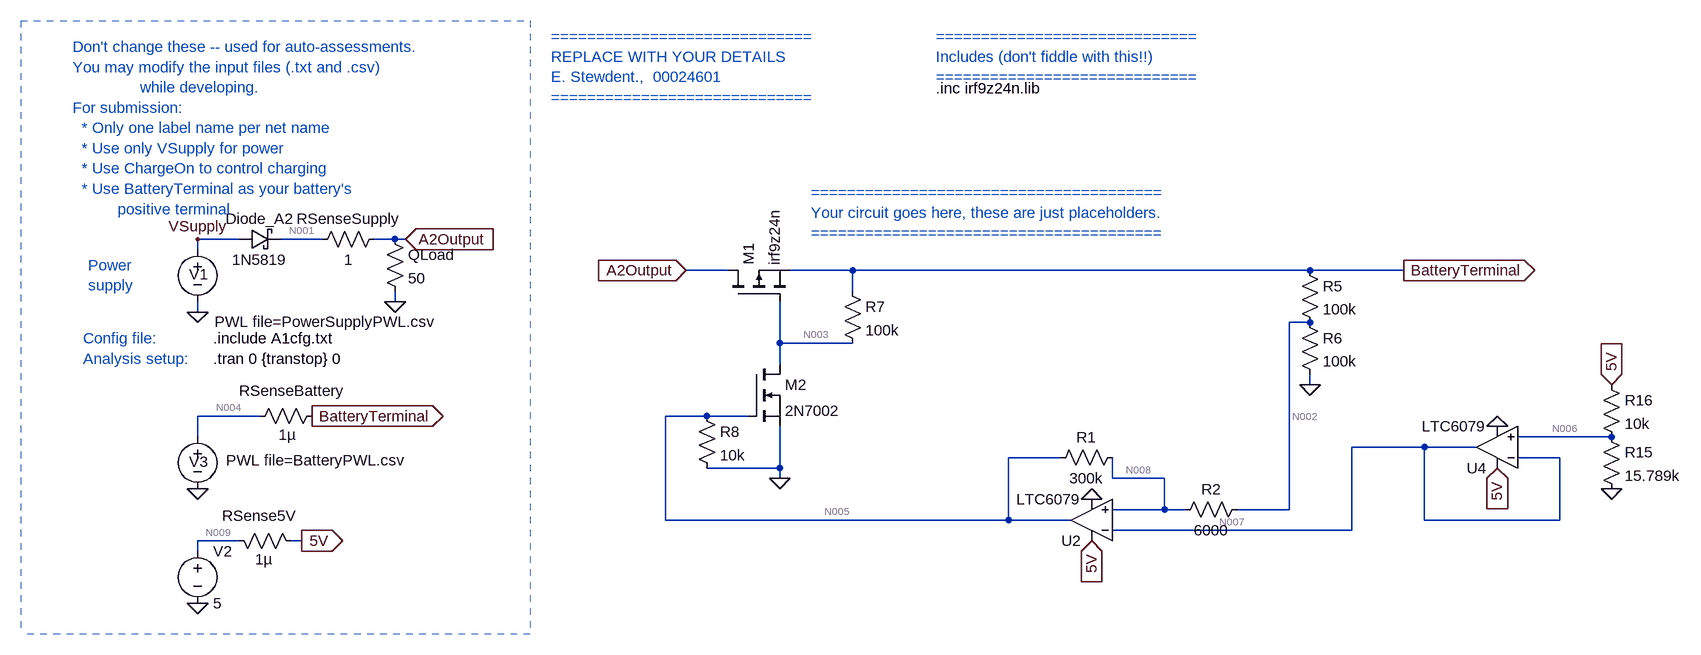
[diagram p0: schematic E344_XXXXXXXX_A3 - Copy.asc]
E344_XXXXXXXX_A3 - Copy.asc, the LTspice schematic file:
Version 4
SHEET 1 1824 680
WIRE -2032 -1088 -2096 -1088
WIRE -1904 -1088 -1968 -1088
WIRE -1792 -1088 -1824 -1088
WIRE -1776 -1088 -1792 -1088
WIRE -2096 -1072 -2096 -1088
WIRE -1280 -1040 -1344 -1040
WIRE -1088 -1040 -1184 -1040
WIRE -384 -1040 -1088 -1040
WIRE -240 -1040 -384 -1040
WIRE -1088 -1008 -1088 -1040
WIRE -1792 -992 -1792 -1008
WIRE -2096 -976 -2096 -992
WIRE -384 -960 -416 -960
WIRE -1200 -928 -1200 -992
WIRE -1088 -928 -1200 -928
WIRE -1200 -896 -1200 -928
WIRE -384 -864 -384 -880
WIRE -2000 -816 -2096 -816
WIRE -1312 -816 -1376 -816
WIRE -1248 -816 -1312 -816
WIRE -2096 -784 -2096 -816
WIRE 80 -784 -64 -784
WIRE -208 -768 -320 -768
WIRE -128 -768 -208 -768
WIRE -768 -752 -848 -752
WIRE 0 -752 -64 -752
WIRE -1200 -736 -1200 -800
WIRE -1200 -736 -1312 -736
WIRE -1200 -720 -1200 -736
WIRE -688 -720 -688 -752
WIRE -608 -720 -688 -720
WIRE -608 -672 -608 -720
WIRE -608 -672 -688 -672
WIRE -576 -672 -608 -672
WIRE -416 -672 -416 -960
WIRE -416 -672 -496 -672
WIRE -1376 -656 -1376 -816
WIRE -848 -656 -848 -752
WIRE -848 -656 -1376 -656
WIRE -752 -656 -848 -656
WIRE -208 -656 -208 -768
WIRE 0 -656 0 -752
WIRE 0 -656 -208 -656
WIRE -320 -640 -320 -768
WIRE -320 -640 -688 -640
WIRE -2032 -624 -2096 -624
WIRE -1936 -624 -1952 -624
WIRE -2096 -608 -2096 -624
FLAG -2096 -976 0
FLAG -1776 -1088 A2Output
IOPIN -1776 -1088 In
FLAG -1920 -816 BatteryTerminal
IOPIN -1920 -816 Out
FLAG -2096 -704 0
FLAG -1936 -624 5V
IOPIN -1936 -624 Out
FLAG -2096 -1088 VSupply
FLAG -1792 -992 0
FLAG -2096 -528 0
FLAG -1200 -720 0
FLAG -720 -624 5V
IOPIN -720 -624 In
FLAG -96 -736 5V
IOPIN -96 -736 In
FLAG 80 -864 5V
IOPIN 80 -864 In
FLAG -720 -688 0
FLAG -96 -800 0
FLAG -384 -864 0
FLAG 80 -704 0
FLAG -240 -1040 BatteryTerminal
IOPIN -240 -1040 Out
FLAG -1344 -1040 A2Output
IOPIN -1344 -1040 In
SYMBOL voltage -2096 -1088 R0
WINDOW 123 0 0 Left 0
WINDOW 39 0 0 Left 0
WINDOW 3 26 127 Left 2
WINDOW 0 -13 54 Left 2
SYMATTR Value PWL file=PowerSupplyPWL.csv
SYMATTR InstName V1
SYMBOL res -1904 -832 R90
WINDOW 0 -7 47 VBottom 2
WINDOW 3 29 54 VTop 2
SYMATTR InstName RSenseBattery
SYMATTR Value 1µ
SYMBOL schottky -2032 -1072 R270
WINDOW 0 32 32 VTop 2
WINDOW 3 0 32 VBottom 2
SYMATTR InstName Diode_A2
SYMATTR Value 1N5819
SYMATTR Description Diode
SYMATTR Type diode
SYMBOL voltage -2096 -800 R0
WINDOW 123 0 0 Left 0
WINDOW 39 0 0 Left 0
WINDOW 3 44 52 Left 2
WINDOW 0 -13 54 Left 2
SYMATTR Value PWL file=BatteryPWL.csv
SYMATTR InstName V3
SYMBOL res -1920 -1072 R270
WINDOW 0 32 56 VTop 2
WINDOW 3 0 56 VBottom 2
SYMATTR InstName RSenseSupply
SYMATTR Value 1
SYMBOL res -1808 -1104 R0
SYMATTR InstName QLoad
SYMATTR Value 50
SYMBOL voltage -2096 -624 R0
WINDOW 123 0 0 Left 0
WINDOW 39 0 0 Left 0
SYMATTR InstName V2
SYMATTR Value 5
SYMBOL res -2048 -640 M90
WINDOW 0 -7 47 VBottom 2
WINDOW 3 29 54 VTop 2
SYMATTR InstName RSense5V
SYMATTR Value 1µ
SYMBOL pmos -1280 -992 R270
SYMATTR InstName M1
SYMATTR Value irf9z24n
SYMATTR Prefix X
SYMATTR SpiceModel irf9z24n
SYMBOL nmos -1248 -896 R0
SYMATTR InstName M2
SYMATTR Value 2N7002
SYMBOL OpAmps\\LTC6079 -720 -656 R180
SYMATTR InstName U2
SYMBOL OpAmps\\LTC6079 -96 -768 R180
SYMATTR InstName U4
SYMBOL res -400 -1056 R0
SYMATTR InstName R5
SYMATTR Value 100k
SYMBOL res -400 -976 R0
SYMATTR InstName R6
SYMATTR Value 100k
SYMBOL res -1104 -1024 R0
SYMATTR InstName R7
SYMATTR Value 100k
SYMBOL res -1328 -832 R0
SYMATTR InstName R8
SYMATTR Value 10k
SYMBOL res 64 -800 R0
SYMATTR InstName R15
SYMATTR Value 15.789k
SYMBOL res 64 -880 R0
SYMATTR InstName R16
SYMATTR Value 10k
SYMBOL res -672 -768 R90
WINDOW 0 0 56 VBottom 2
WINDOW 3 32 56 VTop 2
SYMATTR InstName R1
SYMATTR Value 300k
SYMBOL res -480 -688 R90
WINDOW 0 0 56 VBottom 2
WINDOW 3 32 56 VTop 2
SYMATTR InstName R2
SYMATTR Value 6000
TEXT -2072 -904 Left 2 !.tran 0 {transtop} 0
TEXT -2072 -936 Left 2 !.include A1cfg.txt
TEXT -2288 -1384 Left 2 ;Don't change these -- used for auto-assessments.\nYou may modify the input files (.txt and .csv) \n               while developing.\nFor submission: \n  * Only one label name per net name\n  * Use only VSupply for power\n  * Use ChargeOn to control charging\n  * Use BatteryTerminal as your battery's \n          positive terminal
TEXT -2272 -936 Left 2 ;Config file:
TEXT -2272 -904 Left 2 ;Analysis setup:
TEXT -2264 -1048 Left 2 ;Power\nsupply
TEXT -1552 -1400 Left 2 ;=============================\nREPLACE WITH YOUR DETAILS\nE. Stewdent.,  00024601\n=============================
TEXT -960 -1320 Left 2 !.inc irf9z24n.lib
TEXT -960 -1400 Left 2 ;=============================\nIncludes (don't fiddle with this!!)\n=============================
TEXT -1152 -1160 Left 2 ;=======================================\nYour circuit goes here, these are just placeholders.\n=======================================
LINE Normal -1584 -1424 -1584 -480 2
LINE Normal -2368 -1424 -1584 -1424 2
LINE Normal -1584 -480 -2368 -480 2
LINE Normal -1584 -496 -1584 -496 2
LINE Normal -2368 -1424 -2368 -480 2

The netlist it stands for:
* E344_XXXXXXXX_A3 - Copy.asc
V1 VSupply 0 PWL file=PowerSupplyPWL.csv
RSenseBattery BatteryTerminal N004 1µ
Diode_A2 VSupply N001 1N5819
V3 N004 0 PWL file=BatteryPWL.csv
RSenseSupply N001 A2Output 1
R§QLoad A2Output 0 50
V2 N009 0 5
RSense5V N009 5V 1µ
XM1 A2Output N003 BatteryTerminal irf9z24n irf9z24n  ; pins D G S
M2 N003 N005 0 0 2N7002
XU2 N008 N007 5V 0 N005 LTC6078  ; LTC6079, pins In+ In- V+ V- OUT
XU4 N006 N007 5V 0 N007 LTC6078  ; LTC6079, pins In+ In- V+ V- OUT
R5 BatteryTerminal N002 100k
R6 N002 0 100k
R7 BatteryTerminal N003 100k
R8 N005 0 10k
R15 N006 0 15.789k
R16 5V N006 10k
R1 N008 N005 300k
R2 N002 N008 6000
.model D D
.lib standard.dio
.model NMOS NMOS
.model PMOS PMOS
.lib standard.mos
.tran 0 {transtop} 0
.include A1cfg.txt
* Don't change these -- used for auto-assessments.
* You may modify the input files (.txt and .csv)
*                while developing.
* For submission:
*   * Only one label name per net name
*   * Use only VSupply for power
*   * Use ChargeOn to control charging
*   * Use BatteryTerminal as your battery's
*           positive terminal
* Config file:
* Analysis setup:
* Power
* supply
* =============================
* REPLACE WITH YOUR DETAILS
* E. Stewdent.,  00024601
* =============================
.inc irf9z24n.lib
* =============================
* Includes (don't fiddle with this!!)
* =============================
* =======================================
* Your circuit goes here, these are just placeholders.
* =======================================
.lib LTC5.lib
.backanno
.end

* Results of the author's LTspice run, read from the files saved beside the schematic
* Operating Point, zero values left out:
*   V(vsupply) = 7.4 V
*   V(batteryterminal) = 6.3 V
*   V(n004) = 6.3 V
*   V(n001) = 7.019 V
*   V(a2output) = 6.412 V
*   V(n009) = 5 V
*   V(5v) = 5 V
*   V(n003) = 348.2 µV
*   V(n005) = 2.585 V
*   V(n008) = 3.061 V
*   V(n007) = 3.061 V
*   V(n006) = 3.061 V
*   V(n002) = 3.071 V
*   Id(M2) = 63 µA
*   Is(M2) = -63 µA
*   I(Diode_a2) = 606.6 mA
*   I(R2) = 1.586 µA
*   I(R1) = 1.586 µA
*   I(R16) = 193.9 µA
*   I(R15) = 193.9 µA
*   I(R8) = 258.5 µA
*   I(R7) = 63 µA
*   I(R6) = 30.71 µA
*   I(R5) = 32.29 µA
*   I(Rsense5v) = 541.8 µA
*   I(Qload) = 128.2 mA
*   I(Rsensesupply) = 606.6 mA
*   I(Rsensebattery) = 478.2 mA
*   I(V2) = -541.8 µA
*   I(V3) = 478.2 mA
*   I(V1) = -606.6 mA
*   Ix(m1:1) = 478.3 mA
*   Ix(m1:3) = -478.3 mA
*   Ix(u2:3) = 292.9 µA
*   Ix(u2:4) = -35.94 µA
*   Ix(u2:5) = -257 µA
*   Ix(u4:3) = 54.99 µA
*   Ix(u4:4) = -54.99 µA
*   Ix(u4:5) = -1.412 pA
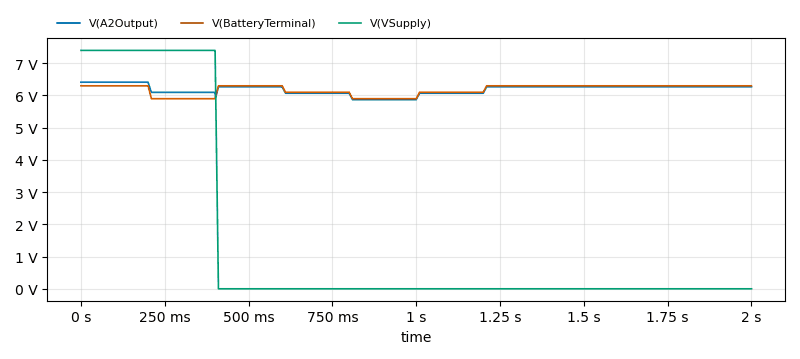
[diagram p1: Transient Analysis of E344_XXXXXXXX_A3 - Copy.asc, plotted from the saved traces]
* Transient Analysis, 1 run:
*   V(A2Output): min 5.869 V, max 6.412 V, average 6.186 V, rms 6.188 V, last 6.27 V
*   V(BatteryTerminal): min 5.9 V, max 6.3 V, average 6.18 V, rms 6.182 V, last 6.3 V
*   V(VSupply): min 0 V, max 7.4 V, average 1.499 V, rms 3.325 V, last 0 V